# Altium schematic sheet DAC.SchDoc
size A4; DocumentNumber: 9; SheetNumber: 9; SheetTotal: 12
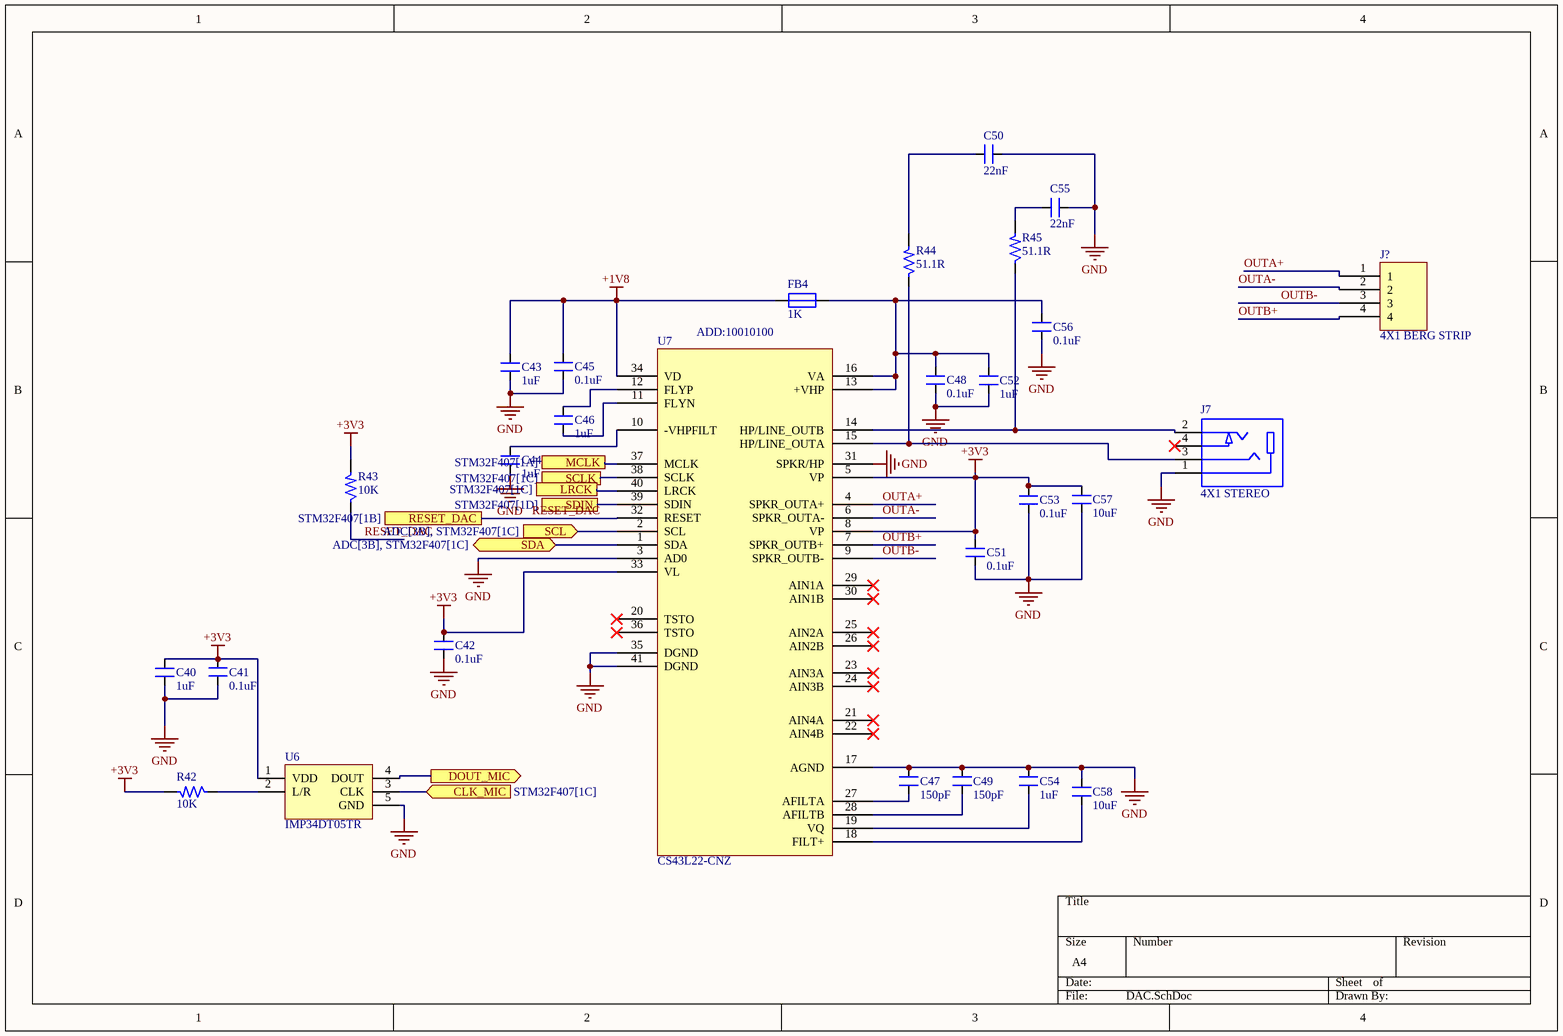
[diagram p0: DAC.SchDoc]

## Parts
C40  1uF  [CAP_0805]
C41  0.1uF  [CAP_0805]
C42  0.1uF  [CAP_0805]
C43  1uF  [CAP_0805]
C44  1uF  [CAP_0805]
C45  0.1uF  [CAP_0805]
C46  1uF  [CAP_0805]
C47  150pF  [CAP_0805]
C48  0.1uF  [CAP_0805]
C49  150pF  [CAP_0805]
C50  22nF  [CAP_0805]
C51  0.1uF  [CAP_0805]
C52  1uF  [CAP_0805]
C53  0.1uF  [CAP_0805]
C54  1uF  [CAP_0805]
C55  22nF  [CAP_0805]
C56  0.1uF  [CAP_0805]
C57  10uF  [CAP_1206]
C58  10uF  [CAP_1206]
FB4  1K  [IND_0805]
J7  4X1 STEREO  [CON_SJ-2504A-SMT-TR_SMD]
J?  4X1 BERG STRIP  [CON4_100_40D72_TH_ST_MALE]
R42  10K  [RES_0603]
R43  10K  [RES_0603]
R44  51.1R  [RES_0603]
R45  51.1R  [RES_0603]
U6  IMP34DT05TR  [HCLGA-4_53_137_15X37_SMD]
U7  CS43L22-CNZ  [QFN40_19_284_33X9_SMD]

## Ports
CLK_MIC (in, see STM32F407[1C]), DOUT_MIC (out), LRCK (see STM32F407[1C]), MCLK (see STM32F407[1A]), RESET_DAC (see STM32F407[1B]), SCL (in, see ADC[3B], STM32F407[1C]), SCLK (see STM32F407[1C]), SDA (bidir, see ADC[3B], STM32F407[1C]), SDIN (see STM32F407[1D])

## Nets
+1V8: C43.2 C45.2 FB4.1 U7.34(VD)
+3V3: C40.2 C41.2 C42.2 C51.2 C53.2 C57.2 R42.2 R43.2 U6.1(VDD) U7.5(VP) U7.8(VP) U7.33(VL)
GND: C40.1 C41.1 C42.1 C43.1 C44.1 C45.1 C47.2 C48.1 C49.2 C50.2 C51.1 C52.1 C53.1 C54.2 C55.2 C56.1 C57.1 C58.2 J7.1 U6.5(GND) U7.3(AD0) U7.17(AGND) U7.31(SPKR/HP) U7.35(DGND) U7.41(DGND)
CLK_MIC: U6.3(CLK) ; port CLK_MIC
DOUT_MIC: U6.4(DOUT) ; port DOUT_MIC
LRCK: U7.40(LRCK) ; port LRCK
MCLK: U7.37(MCLK) ; port MCLK
OUTA+: J?.1 U7.4(SPKR_OUTA+)
OUTA-: J?.2 U7.6(SPKR_OUTA-)
OUTB+: J?.4 U7.7(SPKR_OUTB+)
OUTB-: J?.3 U7.9(SPKR_OUTB-)
RESET_DAC: R43.1 U7.32(RESET) ; port RESET_DAC
SCL: U7.2(SCL) ; port SCL
SCLK: U7.38(SCLK) ; port SCLK
SDA: U7.1(SDA) ; port SDA
SDIN: U7.39(SDIN) ; port SDIN
NetC44_2: C44.2 U7.10(-VHPFILT)
NetC46_1: C46.1 U7.11(FLYN)
NetC46_2: C46.2 U7.12(FLYP)
NetC47_1: C47.1 U7.27(AFILTA)
NetC48_2: C48.2 C52.2 C56.2 FB4.2 U7.13(+VHP) U7.16(VA)
NetC49_1: C49.1 U7.28(AFILTB)
NetC50_1: C50.1 R44.2
NetC54_1: C54.1 U7.19(VQ)
NetC55_1: C55.1 R45.2
NetC58_1: C58.1 U7.18(FILT+)
NetJ7_2: J7.2 R45.1 U7.14(HP/LINE_OUTB)
NetJ7_3: J7.3 R44.1 U7.15(HP/LINE_OUTA)
NetR42_1: R42.1 U6.2(L/R)

Not connected (* = marked no-connect by the designer): J7 4*; U7 20(TSTO)* 21(AIN4A)* 22(AIN4B)* 23(AIN3A)* 24(AIN3B)* 25(AIN2A)* 26(AIN2B)* 29(AIN1A)* 30(AIN1B)* 36(TSTO)*

## Notes on the sheet
- ADD:10010100

## Library data of the parts
C40 C43 C44 C46 C52 C54 = CAP_1uF-50V-5%-0805: 1µF ±5% 50V Ceramic Capacitor X7R 0805 (2012 Metric); Manufacturer: Samsung; Manufacturer Part Number: CC0805JKX7R9BB105; Alternate Part Number-1: 0805F105M500NT; Case/Package: 0805; Supplier-1: SIRICOM; Supplier Part Number-1: CL21B105KBFNNNE
C41 C42 C45 C48 C51 C53 C56 = CAP_0.1uF-50V-20%-0805: 0.1µF ±20% 50V Ceramic Capacitor X7R 0805 (2012 Metric); Manufacturer: Samsung Electro-Mechanics; Manufacturer Part Number: CL21B104MBCNNNC; Alternate Part Number-1: NA; Case/Package: 0805; Supplier-1: SIRICOM; Supplier Part Number-1: 0805B104K500CT
C47 C49 = CAP_150pF-50V-10%-0805: 150pF ±10% 50V Ceramic Capacitor C0G, NP0 0805 (2012 Metric); Manufacturer: AVX Corporation; Manufacturer Part Number: 08055A151KAT2A; Alternate Part Number-1: NA; Case/Package: 0805; Supplier-1: Digikey; Supplier Part Number-1: 478-10501-1-ND - Cut Tape (CT)
C50 C55 = CAP_22nF-50V-10%-0805: 0.022µF ±10% 50V Ceramic Capacitor X7R 0805 (2012 Metric); Manufacturer: Samsung Electro-Mechanics; Manufacturer Part Number: CL21B223KBANNNC; Alternate Part Number-1: NA; Case/Package: 0805; Supplier-1: Digikey; Supplier Part Number-1: 1276-1081-1-ND - Cut Tape (CT)
C57 C58 = CAP_10uF-50V-10%-1206: 10µF ±10% 50V Ceramic Capacitor X7R 1206 (3216 Metric); Manufacturer: KEMET; Manufacturer Part Number: CL31B106KBHNNNE; Alternate Part Number-1: GRT31CR61H106ME01L; Case/Package: 1206; Supplier-1: SIRICOM; Supplier Part Number-1: CC1206KKX5R9BB106
FB4 = FB_1K-100MHZ-1.6A-0805: 1 kOhms @ 100MHz 1 Power Line Ferrite Bead 0805 (2012 Metric) 1.6A; Manufacturer: Laird; Manufacturer Part Number: BLM21SP102SH1D; Alternate Part Number-1: NA; Case/Package: 0805; Supplier-1: SIRICOM; Supplier Part Number-1: ACMS201209A102
J7 = CON-PLG-STEREO_4X1-100-RA-SMD: 2.50mm (0.094", 3/32", Sub Mini, Miniature) - Headphone Phone Jack Stereo (4 Conductor, TRRS) Connector Solder; Manufacturer: CUI Devices; Manufacturer Part Number: SJ-2504A-SMT-TR; Alternate Part Number-1: NA; Case/Package: SMD; Supplier Part Number-1: CP-SJ-2504A-SMT-CT-ND - Cut Tape (CT); Supplier-1: Digikey
J? = CON-BS-PLG_4X1-100-ST-TH: 4 Pins, 1 Row 2.54mm Pitch, Straight bergstrip, Male; Manufacturer: NA; Manufacturer Part Number: NA; Case/Package: TH-CON; Supplier-1: SP ROAD; Supplier Part Number-1: NA; Alternate Part Number-1: NA
R42 R43 = RES_10K-0.1W-1%-0603: 10 kOhms ±1% 0.1W, 1/10W Chip Resistor 0603 (1608 Metric) Automotive AEC-Q200 Thick Film; Manufacturer: Walsin; Manufacturer Part Number: WR06X1002FTL; Alternate Part Number-1: 0603WAJ0103T5E; Case/Package: 0603; Supplier-1: SIRICOM; Supplier Part Number-1: WR06X1002FTL
R44 R45 = RES_51.1R-0.1W-1%-0603: 51.1 Ohms ±1% 0.1W, 1/10W Chip Resistor 0603 (1608 Metric) Thick Film; Manufacturer: Vishay Dale; Manufacturer Part Number: CRCW060351R1FKEAC; Alternate Part Number-1: NA; Case/Package: 0603; Supplier-1: Digikey; Supplier Part Number-1: 541-5468-1-ND - Cut Tape (CT)
U6 = IC_IMP34DT05TR: MEMS Microphones AUTO & INDUSTRIAL SENSORS; Manufacturer: STMicroelectronics; Alternate Part Number-1: NA; Manufacturer Part Number: IMP34DT05TR; Case/Package: HCLGA-4; Supplier-1: Mouser; Supplier Part Number-1: 511-IMP34DT05TR
U7 = IC_CS43L22: Audio D/A Converter ICs Low Power Stereo DAC w/ClassD Spkr Driver; Manufacturer: Cirrus Logic; Alternate Part Number-1: NA; Manufacturer Part Number: CS43L22-CNZ; Case/Package: QFN-40; Supplier-1: Mouser; Supplier Part Number-1: 777-CS43L22-CNZ